# EasyEDA Pro project 通用ARM32位处理器开发板.epro, schematic Schematic1
Create Date: 2024-10-21; Page Name: P1; Project Name: 2024-10-21_通用ARM32位处理器开发板; Schematic Name: Schematic1; Update Date: 2024-11-02; Company: 嘉立创EDA; Page Size: A4; Version: V1.0
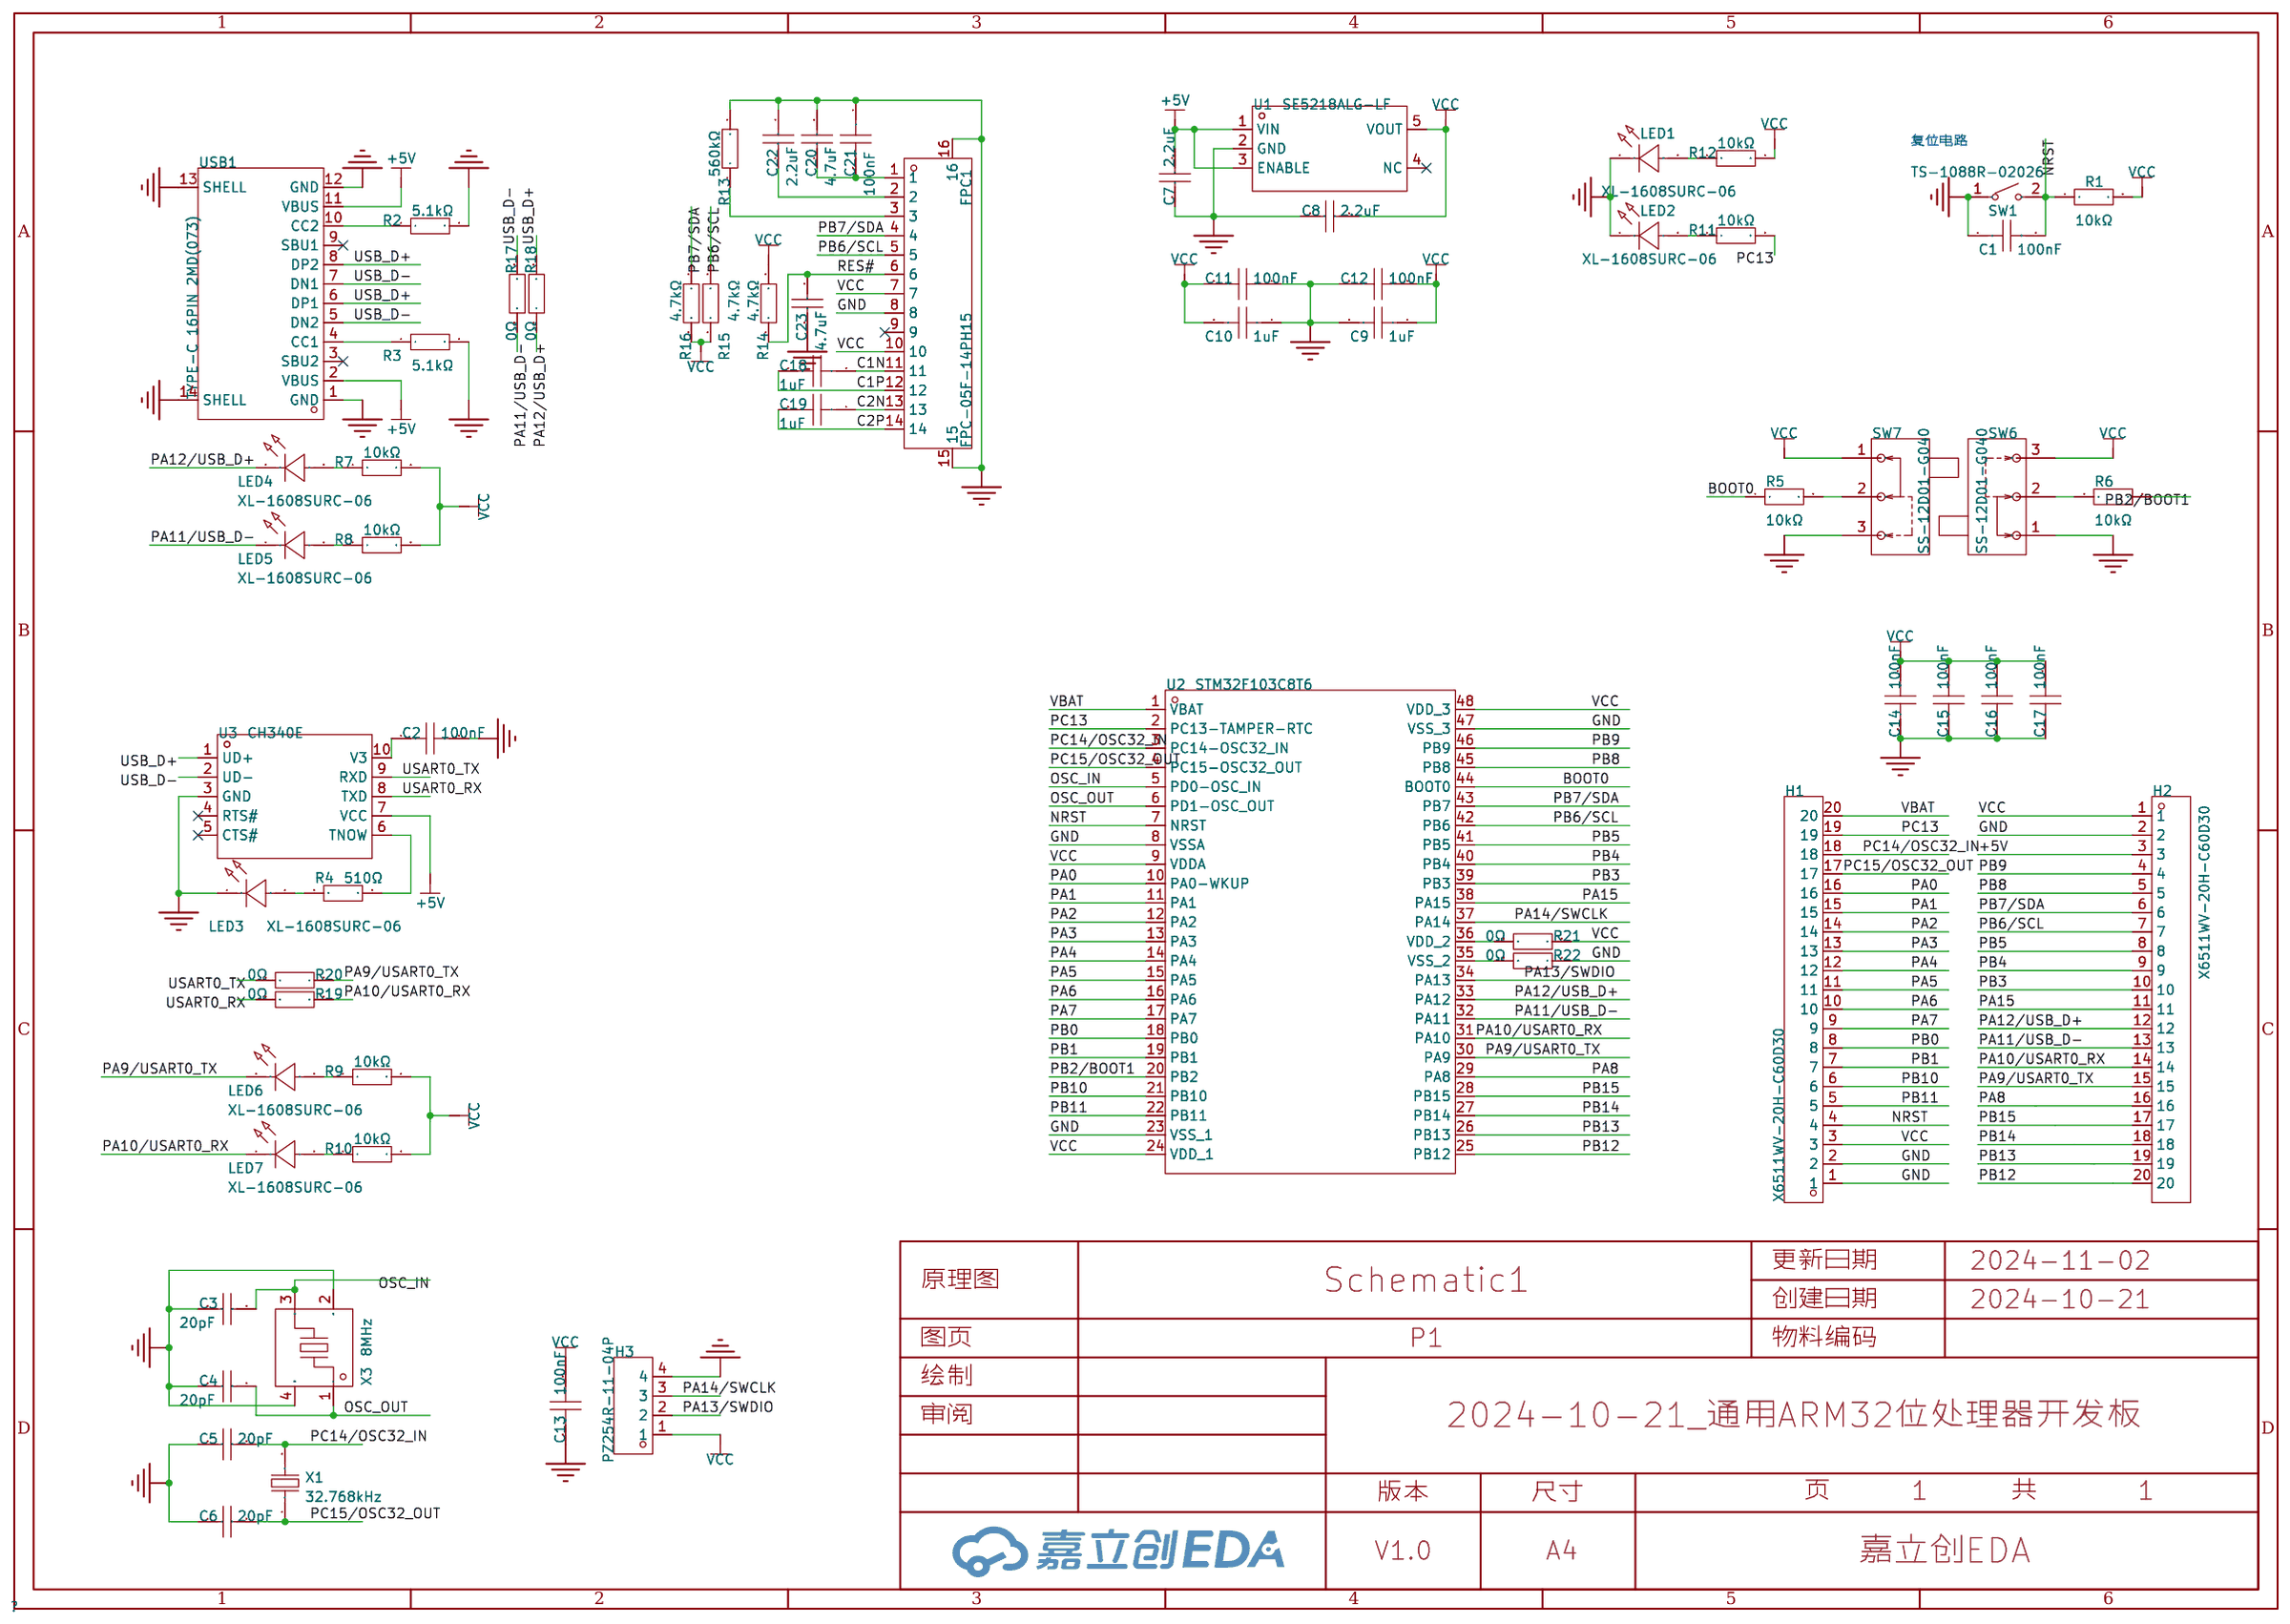
[diagram p0: schematic sheet]

## Parts
C1  100nF  [C0603]
C2  100nF  [C0603]
C3  20pF  [C0603]
C4  20pF  [C0603]
C5  20pF  [C0603]
C6  20pF  [C0603]
C7  2.2uF  [C0603]
C8  2.2uF  [C0603]
C9  1uF  [C0603]
C10  1uF  [C0603]
C11  100nF  [C0603]
C12  100nF  [C0603]
C13  100nF  [C0603]
C14  100nF  [C0603]
C15  100nF  [C0603]
C16  100nF  [C0603]
C17  100nF  [C0603]
C18  1uF  [C0603]
C19  1uF  [C0603]
C20  4.7uF  [C0603]
C21  100nF  [C0603]
C22  2.2uF  [C0603]
C23  4.7uF  [C0603]
FPC1  FPC-05F-14PH15  [FPC-SMD_14P-P0.50_XUNPU_FPC-05F-14PH15]
H1  X6511WV-20H-C60D30  [HDR-TH_20P-P2.54-V-M]
H2  X6511WV-20H-C60D30  [HDR-TH_20P-P2.54-V-M]
H3  PZ254R-11-04P  [HDR-TH_4P-P2.54-H-M-W10.4]
LED1  XL-1608SURC-06  [LED0603-RD_RED]
LED2  XL-1608SURC-06  [LED0603-RD_RED]
LED3  XL-1608SURC-06  [LED0603-RD_RED]
LED4  XL-1608SURC-06  [LED0603-RD_RED]
LED5  XL-1608SURC-06  [LED0603-RD_RED]
LED6  XL-1608SURC-06  [LED0603-RD_RED]
LED7  XL-1608SURC-06  [LED0603-RD_RED]
R1  10kΩ  [R0603]
R2  5.1kΩ  [R0603]
R3  5.1kΩ  [R0603]
R4  510Ω  [R0603]
R5  10kΩ  [R0603]
R6  10kΩ  [R0603]
R7  10kΩ  [R0603]
R8  10kΩ  [R0603]
R9  10kΩ  [R0603]
R10  10kΩ  [R0603]
R11  10kΩ  [R0603]
R12  10kΩ  [R0603]
R13  560kΩ  [R0603]
R14  4.7kΩ  [R0603]
R15  4.7kΩ  [R0603]
R16  4.7kΩ  [R0603]
R17  0Ω  [R0603]
R18  0Ω  [R0603]
R19  0Ω  [R0603]
R20  0Ω  [R0603]
R21  0Ω  [R0603]
R22  0Ω  [R0603]
SW1  TS-1088R-02026  [SW-SMD_L3.9-W3.0-P4.45]
SW6  SS-12D01-G040  [SW-TH_SS-12D01-GX]
SW7  SS-12D01-G040  [SW-TH_SS-12D01-GX]
U1  SE5218ALG-LF  [SOT-23-5_L3.0-W1.7-P0.95-LS2.8-BR]
U2  STM32F103C8T6  [LQFP-48_L7.0-W7.0-P0.50-LS9.0-BL]
U3  CH340E  [MSOP-10_L3.0-W3.0-P0.50-LS5.0-BL]
USB1  TYPE-C 16PIN 2MD(073)  [USB-C-SMD_TYPE-C-6PIN-2MD-073]
X1  32.768kHz  [fc-135r_l3.2-w1.5]
X3  8MHz  [OSC-SMD_4P-L3.2-W2.5-BL]

## Library data of the parts
C1 C2 C11-C17 C21 = CGA0603X7R104K500JT: 容值:100nF;精度:±10%;额定电压:50V;材质(温度系数):X7R;; LCSC Part Name: 100nF ±10% 50V; Supplier Part: C6119867; Manufacturer: HRE(芯声); Supplier Footprint: 0603; JLCPCB Part Class: 扩展库; Supplier: LCSC; Tolerance: ±10%; Voltage Rated: 50V; Temperature Coefficient: X7R
C3-C6 = CL10C200JB8NNNC: 容值:20pF;精度:±5%;额定电压:50V;材质(温度系数):C0G;; LCSC Part Name: 20pF ±5% 50V; Supplier Part: C1648; Manufacturer: SAMSUNG(三星); Supplier Footprint: 0603; JLCPCB Part Class: 基础库; Datasheet: https://atta.szlcsc.com/upload/public/pdf/source/20160218/1457707763339.pdf; Supplier: LCSC; Tolerance: ±5%; Voltage Rated: 50V; Temperature Coefficient: C0G
C7 C8 C22 = CL10A225KO8NNNC: 容值:2.2uF;精度:±10%;额定电压:16V;材质(温度系数):X5R;; LCSC Part Name: 2.2uF ±10% 16V; Supplier Part: C23630; Manufacturer: SAMSUNG(三星); Supplier Footprint: 0603; JLCPCB Part Class: 基础库; Datasheet: https://atta.szlcsc.com/upload/public/pdf/source/20160218/1457707763339.pdf; Supplier: LCSC; Tolerance: ±10%; Voltage Rated: 16V; Temperature Coefficient: X5R
C9 C10 C18 C19 = CGA0603X5R105K160JT: 容值:1uF;精度:±10%;额定电压:16V;材质(温度系数):X5R;; LCSC Part Name: 1uF ±10% 16V; Supplier Part: C6119849; Manufacturer: HRE(芯声); Supplier Footprint: 0603; JLCPCB Part Class: 扩展库; Supplier: LCSC; Tolerance: ±10%; Voltage Rated: 16V; Temperature Coefficient: X5R
C20 C23 = CL10A475KP8NNNC: 容值:4.7uF;精度:±10%;额定电压:10V;材质(温度系数):X5R;; LCSC Part Name: 4.7uF ±10% 10V; Supplier Part: C1705; Manufacturer: SAMSUNG(三星); Supplier Footprint: 0603; JLCPCB Part Class: 扩展库; Datasheet: https://atta.szlcsc.com/upload/public/pdf/source/20160218/1457707763339.pdf; Supplier: LCSC; Tolerance: ±10%; Voltage Rated: 10V; Temperature Coefficient: X5R
FPC1 = FPC-05F-14PH15: 锁定特性:翻盖式;触点类型:下接;触点数量:14P;间距:0.5mm;安装类型:卧贴;工作温度范围:-25℃~+85℃;; LCSC Part Name: 间距:0.5mm P数:14P 翻盖式 下接; Supplier Part: C2856818; Manufacturer: XUNPU(讯普); Supplier Footprint: SMD,P=0.5mm,卧贴; JLCPCB Part Class: 扩展库; Datasheet: https://atta.szlcsc.com/upload/public/pdf/source/20210922/C2856818_BF9A09706769A6AB1B749235C5052B10.pdf; Supplier: LCSC; Locking Feature: 翻盖式; Contact Type: 下接; Number of Contacts: 14P; Pitch: 0.5mm; Mounting Type: 卧贴; FFC, FCB Thickness: 0.3mm; Height Above Board: 1.5mm; Operating Temperature Range: -25℃~+85℃
H1 H2 = X6511WV-20H-C60D30: 插针结构:1x20P;间距:2.54mm;行距:2.54mm;圆针/方针:方针;安装类型:-;排数:单排;总PIN位数:20P;额定电流:3A;额定电压:250V;配合针长度:-;塑高:2.5mm;端接针长度:-;触头材质:黄铜;触头镀层:金;工作温度范围:-40℃~+105℃;焊接温度(最大值):260℃;颜色:黑色;; LCSC Part Name: 1x20P 间距:2.54mm 方针; Supplier Part: C725952; Manufacturer: XKB Connection(中国星坤); Supplier Footprint: 插件,P=2.54mm; JLCPCB Part Class: 扩展库; Datasheet: https://atta.szlcsc.com/upload/public/pdf/source/20221108/2FDDF9C694C8EDC81165E23F2EAAE597.pdf; Supplier: LCSC; Pin Structure: 1x20P; Pitch: 2.54mm; Row Spacing: 2.54mm; Circluar Pins/Square Pins: 方针; Number of Rows: 单排; Number of Pins: 20P; Current Rating (Max): 3A; Voltage Rating (Max): 250V; Insulation Height: 2.5mm; Contact Material: 黄铜; Contact Plating: 金; Operating Temperature Range: -40℃~+105℃; Soldering Temperature(Max): 260℃; Color: 黑色
H3 = PZ254R-11-04P: 插针结构:1x4P;间距:2.54mm;行距:-;圆针/方针:方针;安装类型:弯插;排数:单排;总PIN位数:4P;额定电流:-;额定电压:-;配合针长度:6mm;塑高:2.5mm;触头材质:黄铜;触头镀层:-;工作温度范围:-40℃~+105℃;颜色:黑色;; LCSC Part Name: 间距:2.54mm 1x4P 弯插 方针; Supplier Part: C492412; Manufacturer: XFCN(兴飞); Supplier Footprint: 弯插,P=2.54mm; JLCPCB Part Class: 扩展库; Datasheet: https://atta.szlcsc.com/upload/public/pdf/source/20200309/C492412_B0EFFC1946AB079B8871416C4A09EF6C.pdf; Supplier: LCSC; Pin Structure: 1x4P; Pitch: 2.54mm; Circluar Pins/Square Pins: 方针; Mounting Type: 弯插; Number of Rows: 单排; Number of Pins: 4P; Length of Mating Pin: 6mm; Insulation Height: 2.5mm; Contact Material: 黄铜; Operating Temperature Range: -40℃~+105℃; Color: 黑色
LED1-LED7 = XL-1608SURC-06: 发光颜色:红色;功率:55mW;正向电流:25mA;主波长:617nm~621nm;透镜颜色:无色透明透镜;色温:-;发光角度:120°;载带方式:正贴;工作温度:-30℃~+85℃;; Supplier Part: C965799; Manufacturer: XINGLIGHT(成兴光); Supplier Footprint: 0603; JLCPCB Part Class: 扩展库; Datasheet: https://atta.szlcsc.com/upload/public/pdf/source/20221102/D860AFDD1CDB02C5A8064103A32707E2.pdf; Supplier: LCSC; Emitted Color: 红色; Power Dissipation: 55mW; Forward Current: 25mA; Dominant Wavelength: 617nm~621nm; Peak Wavelength: 623nm; Lens Color: 无色透明透镜; Viewing Angle: 120°; Mounting Sytle: 正贴; Operating Temperature: -30℃~+85℃
R1 R5-R12 = 0603WAF1002T5E: 电阻类型:厚膜电阻;阻值:10kΩ;精度:±1%;功率:100mW;最大工作电压:75V;温度系数:±100ppm/℃;; LCSC Part Name: 厚膜电阻 10kΩ ±1% 100mW; Supplier Part: C25804; Manufacturer: UNI-ROYAL(厚声); Supplier Footprint: 0603; JLCPCB Part Class: 基础库; Datasheet: https://atta.szlcsc.com/upload/public/pdf/source/20200306/C422600_1E6D84923E4A46A82E41ADD87F860B5C.pdf; Supplier: LCSC; Type: 厚膜电阻; Tolerance: ±1%; Power(Watts): 100mW; Overload Voltage (Max): 75V; Temperature Coefficient: ±100ppm/℃; Operating Temperature Range: -55℃~+155℃
R2 R3 = 0603WAF5101T5E: 电阻类型:厚膜电阻;阻值:5.1kΩ;精度:±1%;功率:100mW;最大工作电压:75V;温度系数:±100ppm/℃;; LCSC Part Name: 5.1kΩ ±1% 100mW 厚膜电阻; Supplier Part: C23186; Manufacturer: UNI-ROYAL(厚声); Supplier Footprint: 0603; JLCPCB Part Class: 基础库; Datasheet: https://atta.szlcsc.com/upload/public/pdf/source/20200306/C422600_1E6D84923E4A46A82E41ADD87F860B5C.pdf; Supplier: LCSC; Type: 厚膜电阻; Tolerance: ±1%; Power(Watts): 100mW; Overload Voltage (Max): 75V; Temperature Coefficient: ±100ppm/℃; Operating Temperature Range: -55℃~+155℃
R4 = 0603WAF5100T5E: 电阻类型:厚膜电阻;阻值:510Ω;精度:±1%;功率:100mW;最大工作电压:75V;温度系数:±100ppm/℃;; LCSC Part Name: 510Ω ±1% 100mW 厚膜电阻; Supplier Part: C23193; Manufacturer: UNI-ROYAL(厚声); Supplier Footprint: 0603; JLCPCB Part Class: 基础库; Datasheet: https://atta.szlcsc.com/upload/public/pdf/source/20200306/C422600_1E6D84923E4A46A82E41ADD87F860B5C.pdf; Supplier: LCSC; Type: 厚膜电阻; Tolerance: ±1%; Power(Watts): 100mW; Overload Voltage (Max): 75V; Temperature Coefficient: ±100ppm/℃; Operating Temperature Range: -55℃~+155℃
R13 = 0603WAF5603T5E: 电阻类型:厚膜电阻;阻值:560kΩ;精度:±1%;功率:100mW;最大工作电压:75V;温度系数:±100ppm/℃;; LCSC Part Name: 560kΩ ±1% 100mW 厚膜电阻; Supplier Part: C23203; Manufacturer: UNI-ROYAL(厚声); Supplier Footprint: 0603; JLCPCB Part Class: 扩展库; Datasheet: https://atta.szlcsc.com/upload/public/pdf/source/20200306/C422600_1E6D84923E4A46A82E41ADD87F860B5C.pdf; Supplier: LCSC; Type: 厚膜电阻; Tolerance: ±1%; Power(Watts): 100mW; Overload Voltage (Max): 75V; Temperature Coefficient: ±100ppm/℃; Operating Temperature Range: -55℃~+155℃
R14-R16 = 0603WAF4701T5E: 电阻类型:厚膜电阻;阻值:4.7kΩ;精度:±1%;功率:100mW;最大工作电压:75V;温度系数:±100ppm/℃;; LCSC Part Name: 4.7kΩ ±1% 100mW 厚膜电阻; Supplier Part: C23162; Manufacturer: UNI-ROYAL(厚声); Supplier Footprint: 0603; JLCPCB Part Class: 基础库; Datasheet: https://atta.szlcsc.com/upload/public/pdf/source/20200306/C422600_1E6D84923E4A46A82E41ADD87F860B5C.pdf; Supplier: LCSC; Type: 厚膜电阻; Tolerance: ±1%; Power(Watts): 100mW; Overload Voltage (Max): 75V; Temperature Coefficient: ±100ppm/℃; Operating Temperature Range: -55℃~+155℃
R17-R22 = 0603WAF0000T5E: 电阻类型:厚膜电阻;阻值:0Ω;精度:±1%;功率:100mW;最大工作电压:75V;; LCSC Part Name: 0Ω ±1% 100mW 厚膜电阻; Supplier Part: C21189; Manufacturer: UNI-ROYAL(厚声); Supplier Footprint: 0603; JLCPCB Part Class: 基础库; Datasheet: https://atta.szlcsc.com/upload/public/pdf/source/20200306/C422600_1E6D84923E4A46A82E41ADD87F860B5C.pdf; Supplier: LCSC; Type: 厚膜电阻; Tolerance: ±1%; Power(Watts): 100mW; Overload Voltage (Max): 75V; Operating Temperature Range: -55℃~+155℃
SW1 = TS-1088R-02026: 电路结构:单刀单掷;按钮形状:圆形按钮;安装方式:立贴;开关长度:3.9mm;开关宽度:2.93mm;开关高度:2mm;触点电流:50mA;额定电压(DC):12V;带灯:-;机械寿命:-;; LCSC Part Name: 3.9*2.93*2mm 立贴 轻触开关; Supplier Part: C455280; Manufacturer: XUNPU(讯普); Supplier Footprint: SMD,3x4mm; JLCPCB Part Class: 扩展库; Datasheet: https://atta.szlcsc.com/upload/public/pdf/source/20191118/C455281_EC5379764BC1462550DF64BBBFEA9579.pdf; Supplier: LCSC; Circuit: 单刀单掷; Actuator Style: 圆形按钮; Mounting Style: 立贴; Switch Length: 3.9mm; Switch Width: 2.93mm; Switch Height: 2mm; Contact Current: 50mA; Voltage Rating (DC): 12V
SW6 SW7 = SS-12D01-G040: 电路结构:单刀双掷;安装方式:直插;开关颜色:黑色;额定电流(DC):1A;额定电压(DC):24V;机械寿命:1万次;; LCSC Part Name: 柄长4mm 直插两档 滑动开关; Supplier Part: C2876014; Manufacturer: G-Switch(品赞); Supplier Footprint: 插件; JLCPCB Part Class: 扩展库; Datasheet: https://atta.szlcsc.com/upload/public/pdf/source/20210810/0CA2F64BF042D47765A79AF72E59A163.pdf; Supplier: LCSC; Circuit: 单刀双掷; Actuator Style: 矩形柱状; Pin Style: PC引脚; Switch Length: 8.8mm; Switch Width: 3.9mm; Switch Height: 7.5mm; Mounting Style: 直插; Actuator Color: 黑色; Current Rating (DC): 1A; Voltage Rating (DC): 24V; Mechanical Life: 1万次; Operating Temperature: -25℃~+70℃
U1 = SE5218ALG-LF: 输出类型:可调;最大输入电压:5V;输出电压:3.3V;最大输出电流:500mA;电源纹波抑制比(PSRR):75dB;输出极性:正极;; LCSC Part Name: ADJ 输入5V 输出3.3V 500mA; Supplier Part: C118233; Manufacturer: SEAWARD(思旺); Supplier Footprint: SOT-23-5; JLCPCB Part Class: 扩展库; Datasheet: https://atta.szlcsc.com/upload/public/pdf/source/20170918/C118234_1505726819203976145.pdf; Supplier: LCSC; Output Type: 可调; Maximum Input Voltage: 5V; Output Voltage: 3.3V; MAX Output Current: 500mA; Power Supply Rejection Ratio (PSRR): 75dB; Dropout Voltage: 600mV@(400mA); standby current: 35uA; Output Polarity: 正极; Number of Outputs: 1
U2 = STM32F103C8T6: CPU内核:ARM-M3;程序存储容量:64KB;RAM总容量:20KB;GPIO端口数量:37;工作电压范围:2V~3.6V;CPU最大主频:72MHz;程序存储器类型:FLASH;; LCSC Part Name: 主流增强型ARM Cortex-M3 MCU，具有64 KB Flash、72 MHz CPU、电机控制、USB和CAN; Supplier Part: C8734; Manufacturer: ST(意法半导体); Supplier Footprint: LQFP-48(7x7); JLCPCB Part Class: 扩展库; Datasheet: https://atta.szlcsc.com/upload/public/pdf/source/20220812/8363ACEC51AD55ECEB84799464F7CB85.pdf; Supplier: LCSC; CPU Core: ARM-M3; Program Storage Size: 64KB; RAM Size: 20KB; GPIO Ports Number: 37; Operating Voltage Range: 2V~3.6V; CPU Maximum Speed: 72MHz; Program Memory Type: FLASH; Operating Temperature Range: -40℃~+85℃; ADC (Bit): 12bit; Universal Serial Bus: 有; Peripheral/Function: 看门狗；DMA；看门狗；温度传感器; Watchdog: 有; Infrared Data Association: 有; Low-Voltage Detect: 有; Direct Memory Access: 有; Internal Oscillator: 有
U3 = CH340E: 应用功能:收发器;接口协议:USB 2.0;数据速率:2Mbps;; LCSC Part Name: USB转串口芯片 CH340; Supplier Part: C99652; Manufacturer: WCH(南京沁恒); Supplier Footprint: MSOP-10; JLCPCB Part Class: 扩展库; Datasheet: https://atta.szlcsc.com/upload/public/pdf/source/20230530/6E401E9554E9F5311886CC8B3F89B62E.pdf; Supplier: LCSC; Applications Function: 收发器; Protocol: USB 2.0; Supply Voltage: 3.3V；5V; Data Rate: 2Mbps
USB1 = TYPE-C 16PIN 2MD(073): 连接器类型:Type-C;标准:USB 3.1;公母:母;安装方式:卧贴;触点数量:16P;端口数量:1;额定电流 - 电源:5A;工作温度范围:-25℃~+85℃;; LCSC Part Name: Type-C 母 卧贴; Supplier Part: C2765186; Manufacturer: SHOU HAN(首韩); Supplier Footprint: SMD; JLCPCB Part Class: 扩展库; Datasheet: https://atta.szlcsc.com/upload/public/pdf/source/20211123/39B17C16241EAC15C5E277BDA434118E.pdf; Supplier: LCSC; Connector Type: Type-C; Standard: USB 3.1; Gender: 母; Mounting Style: 卧贴; Number of Contacts: 16P; Number of Ports: 1; Current Rating - Power (Max): 5A; Operating Temperature Range: -25℃~+85℃; Rated Voltage (Max): 5V; Connect-Disconnect Life: 5千次; Core Colour: 黑色
X1 = Q13FC13500004_C32346: 晶振类型:贴片晶振;频率:32.768kHz;常温频差:±20ppm;外接负载电容:12.5pF;; LCSC Part Name: 32.768kHz ±20ppm 12.5pF; Supplier Part: C32346; Manufacturer: EPSON(爱普生); Manufacturer Part: Q13FC13500004; Supplier Footprint: SMD3215-2P; JLCPCB Part Class: 基础库; Datasheet: https://atta.szlcsc.com/upload/public/pdf/source/20240418/0E0FF5F0356BA3753F616001439D1416.pdf; Supplier: LCSC; Crystal Type: 贴片晶振; Normal temperature Frequency Tolerance: ±20ppm; External load capacitor: 12.5pF; Equivalent Series Resistance (ESR): 70kΩ; Operating Temperature: -40℃~+85℃
X3 = X32258MOB4SI: 晶振类型:贴片晶振;频率:8MHz;常温频差:±10ppm;外接负载电容:12pF;频率稳定度(全温):±20ppm;; LCSC Part Name: 8MHz ±10ppm 12pF; Supplier Part: C2682775; Manufacturer: YXC(扬兴晶振); Supplier Footprint: SMD3225-4P; JLCPCB Part Class: 扩展库; Datasheet: https://atta.szlcsc.com/upload/public/pdf/source/20240329/19D5F850207469550BEB00D7DFEDBC7A.pdf; Supplier: LCSC; Crystal Type: 贴片晶振; Normal temperature Frequency Tolerance: ±10ppm; External load capacitor: 12pF; Frequency Stability(Full temperature range): ±20ppm; Equivalent Series Resistance (ESR): 150Ω; Operating Temperature: -40℃~+85℃

## Nets
+5V: C7.2 H2.3 U1.1(VIN) U1.3(ENABLE) U3.7(VCC) USB1.2(VBUS) USB1.11(VBUS)
GND: C1.1 C2.2 C3.1 C4.1 C5.1 C6.1 C7.1 C8.2 C9.2 C10.1 C11.1 C12.2 C13.2 C14.2 C15.2 C16.2 C17.2 C20.2 C21.1 C22.1 C23.1 FPC1.8 FPC1.15 FPC1.16 H1.1 H1.2 H2.2 H3.4 LED1.1(K) LED2.1(K) LED3.1(K) R2.2 R3.2 R13.2 R22.1 SW1.1 SW6.1 SW7.3 U1.2(GND) U2.8(VSSA) U2.23(VSS_1) U2.47(VSS_3) U3.3(GND) USB1.1(GND) USB1.12(GND) USB1.13(SHELL) USB1.14(SHELL) X3.2(GND) X3.4(GND)
VBAT: H1.20 U2.1(VBAT)
VCC: C8.1 C9.1 C10.2 C11.2 C12.1 C13.1 C14.1 C15.1 C16.1 C17.1 FPC1.7 FPC1.10 H1.3 H2.1 H3.1 R1.2 R7.2 R8.2 R9.2 R10.2 R12.2 R14.2 R15.1 R16.2 R21.1 SW6.3 SW7.1 U1.5(VOUT) U2.9(VDDA) U2.24(VDD_1) U2.48(VDD_3)
BOOT0: R5.1 U2.44(BOOT0)
C1N: C18.2 FPC1.11
C1P: C18.1 FPC1.12
C2N: C19.1 FPC1.13
C2P: C19.2 FPC1.14
NRST: C1.2 H1.4 R1.1 SW1.2 U2.7(NRST)
OSC_IN: C3.2 U2.5(PD0-OSC_IN) X3.3
OSC_OUT: C4.2 U2.6(PD1-OSC_OUT) X3.1
PA0: H1.16 U2.10(PA0-WKUP)
PA1: H1.15 U2.11(PA1)
PA2: H1.14 U2.12(PA2)
PA3: H1.13 U2.13(PA3)
PA4: H1.12 U2.14(PA4)
PA5: H1.11 U2.15(PA5)
PA6: H1.10 U2.16(PA6)
PA7: H1.9 U2.17(PA7)
PA8: H2.16 U2.29(PA8)
PA9/USART0_TX: H2.15 LED6.1(K) R20.1 U2.30(PA9)
PA10/USART0_RX: H2.14 LED7.1(K) R19.1 U2.31(PA10)
PA11/USB_D-: H2.13 LED5.1(K) R17.1 U2.32(PA11)
PA12/USB_D+: H2.12 LED4.1(K) R18.1 U2.33(PA12)
PA13/SWDIO: H3.2 U2.34(PA13)
PA14/SWCLK: H3.3 U2.37(PA14)
PA15: H2.11 U2.38(PA15)
PB0: H1.8 U2.18(PB0)
PB1: H1.7 U2.19(PB1)
PB2/BOOT1: R6.2 U2.20(PB2)
PB3: H2.10 U2.39(PB3)
PB4: H2.9 U2.40(PB4)
PB5: H2.8 U2.41(PB5)
PB6/SCL: FPC1.5 H2.7 R15.2 U2.42(PB6)
PB7/SDA: FPC1.4 H2.6 R16.1 U2.43(PB7)
PB8: H2.5 U2.45(PB8)
PB9: H2.4 U2.46(PB9)
PB10: H1.6 U2.21(PB10)
PB11: H1.5 U2.22(PB11)
PB12: H2.20 U2.25(PB12)
PB13: H2.19 U2.26(PB13)
PB14: H2.18 U2.27(PB14)
PB15: H2.17 U2.28(PB15)
PC13: H1.19 R11.2 U2.2(PC13-TAMPER-RTC)
PC14/OSC32_IN: C5.2 H1.18 U2.3(PC14-OSC32_IN) X1.2
PC15/OSC32_OUT: C6.2 H1.17 U2.4(PC15-OSC32_OUT) X1.1
RES#: C23.2 FPC1.6 R14.1
USART0_RX: R19.2 U3.8(TXD)
USART0_TX: R20.2 U3.9(RXD)
USB_D+: R18.2 U3.1(UD+) USB1.6(DP1) USB1.8(DP2)
USB_D-: R17.2 U3.2(UD-) USB1.5(DN2) USB1.7(DN1)
$1N2106: C2.1 U3.10(V3)
$1N2935: R3.1 USB1.4(CC1)
$1N2938: R2.1 USB1.10(CC2)
$1N3166: R4.2 U3.6(TNOW)
$1N3169: LED3.2(A) R4.1
$1N4228: R5.2 SW7.2
$1N4237: R6.1 SW6.2
$1N6427: LED4.2(A) R7.1
$1N6466: LED5.2(A) R8.1
$1N6674: LED6.2(A) R9.1
$1N6676: LED7.2(A) R10.1
$1N10384: LED1.2(A) R12.1
$1N10388: LED2.2(A) R11.1
$1N10989: C20.1 C21.2 FPC1.1
$1N10994: C22.2 FPC1.2
$1N11001: FPC1.3 R13.1
$1N13630: R21.2 U2.36(VDD_2)
$1N13674: R22.2 U2.35(VSS_2)

Not connected (* = marked no-connect by the designer): FPC1 9*; U1 4(NC)*; U3 4(RTS#)* 5(CTS#)*; USB1 3(SBU2)* 9(SBU1)*

## Notes on the sheet
- 复位电路
